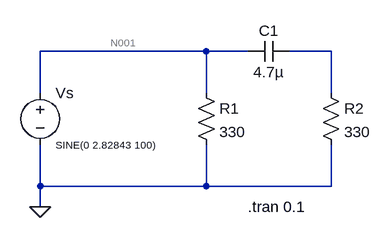
[diagram p0: schematic Circuito_Simulacion.asc]
Circuito_Simulacion.asc, the LTspice schematic file:
Version 4
SHEET 1 880 680
WIRE 304 80 48 80
WIRE 368 80 304 80
WIRE 496 80 432 80
WIRE 48 144 48 80
WIRE 304 144 304 80
WIRE 496 144 496 80
WIRE 48 288 48 224
WIRE 304 288 304 224
WIRE 304 288 48 288
WIRE 496 288 496 224
WIRE 496 288 304 288
WIRE 48 320 48 288
FLAG 48 320 0
SYMBOL voltage 48 128 R0
WINDOW 3 24 96 Left 1
WINDOW 123 0 0 Left 0
WINDOW 39 0 0 Left 0
SYMATTR Value SINE(0 2.82843 100)
SYMATTR InstName Vs
SYMBOL res 288 128 R0
SYMATTR InstName R1
SYMATTR Value 330
SYMBOL res 480 128 R0
SYMATTR InstName R2
SYMATTR Value 330
SYMBOL cap 432 64 R90
WINDOW 0 0 32 VBottom 2
WINDOW 3 32 32 VTop 2
SYMATTR InstName C1
SYMATTR Value 4.7µ
TEXT 368 320 Left 2 !.tran 0.1

The netlist it stands for:
* Circuito_Simulacion.asc
Vs N001 0 SINE(0 2.82843 100)
R1 N001 0 330
R2 N002 0 330
C1 N002 N001 4.7µ
.tran 0.1
.backanno
.end

* Results of the author's LTspice run, read from the files saved beside the schematic
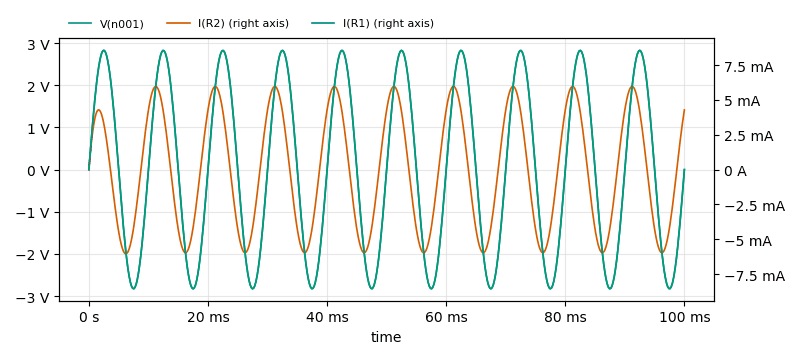
[diagram p1: Transient Analysis of Circuito_Simulacion.asc, plotted from the saved traces]
* Transient Analysis, 1 run:
*   V(n001): min -2.828 V, max 2.828 V, average 69.87 µV, rms 2 V, last 0 V
*   I(R2): min -6.054 mA, max 5.977 mA, average -66.35 µA, rms 4.176 mA, last 4.284 mA
*   I(R1): min -8.563 mA, max 8.563 mA, average 211.8 nA, rms 6.055 mA, last 0 A